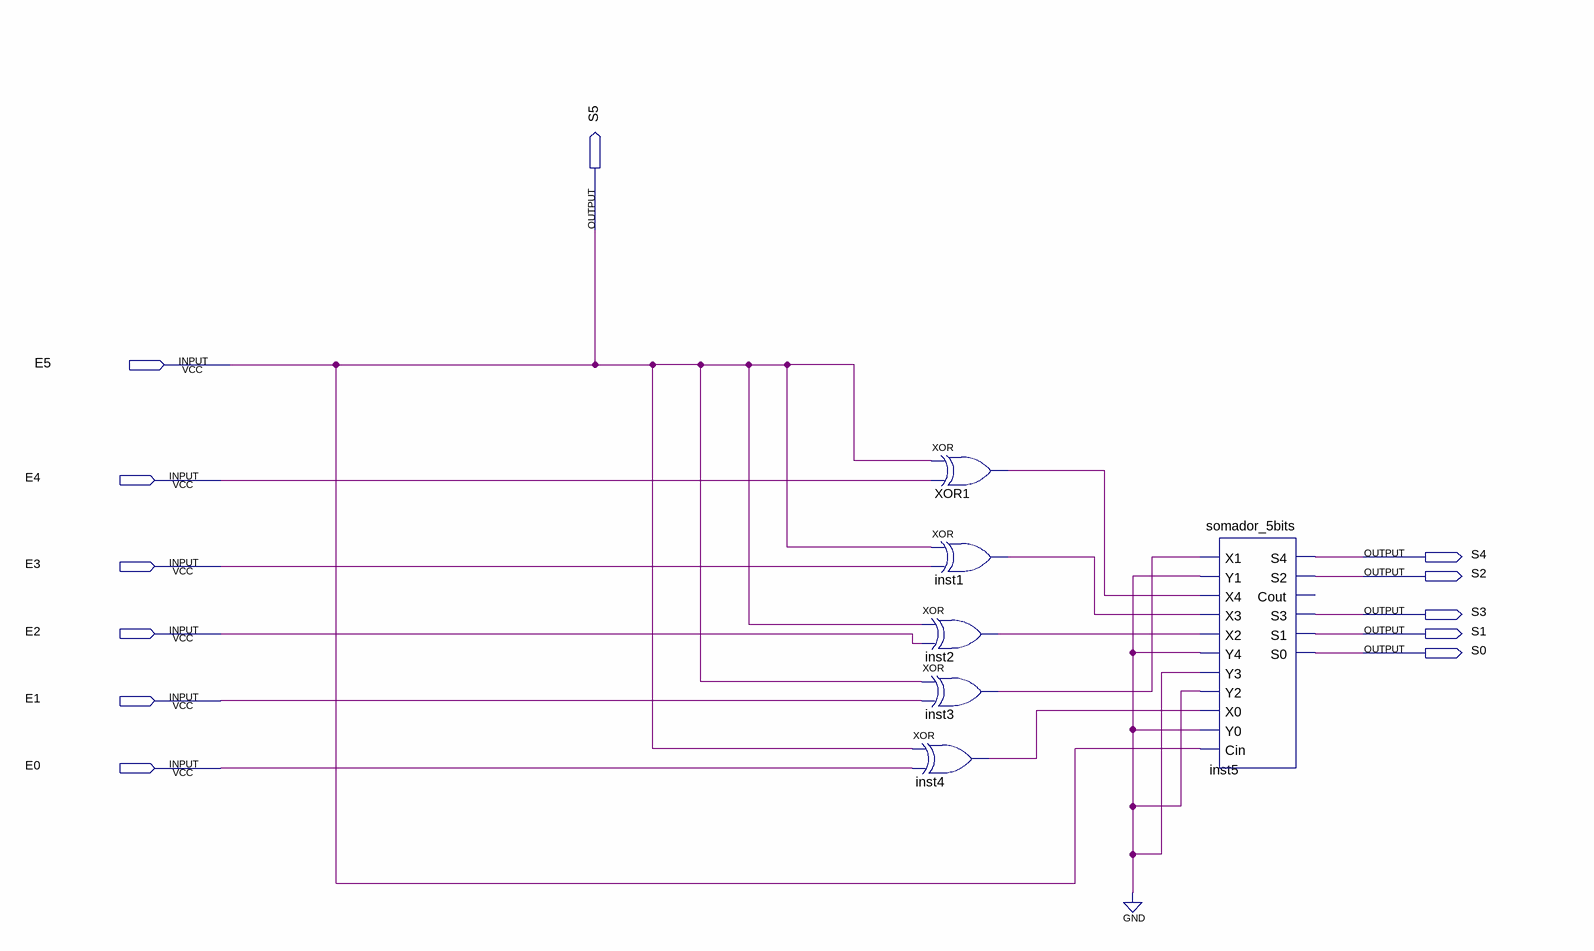
[diagram p0: schematic sheet]
// Quartus schematic conversor_saida.bdf as structural Verilog: 6 symbols, 12 pins
module conversor_saida (
  input  E5,
  input  E4,
  input  E3,
  input  E2,
  input  E1,
  input  E0,
  output S5,
  output S4,
  output S2,
  output S3,
  output S1,
  output S0
);

  wire inst1_out, inst2_out, inst3_out, inst4_out, XOR1_out;

  xor XOR1 (XOR1_out, E5, E4);
  xor inst1 (inst1_out, E5, E3);
  xor inst2 (inst2_out, E5, E2);
  xor inst3 (inst3_out, E5, E1);
  xor inst4 (inst4_out, E5, E0);
  somador_5bits inst5 (
    .X1(inst3_out), .Y1(1'b0), .X4(XOR1_out), .X3(inst1_out), .X2(inst2_out), .Y4(1'b0), .Y3(1'b0),
    .Y2(1'b0), .X0(inst4_out), .Y0(1'b0), .Cin(E5), .S4(S4), .S2(S2), .S3(S3), .S1(S1), .S0(S0));  // open: Cout

  assign S5 = E5;
endmodule
